# Altium schematic sheet POWER_PCie.SchDoc: DARKYDEN_POWERPCie
size Letter; ApprovedBy: APPROUVÉ PAR; Author: Harold Malbrouck; Organization: Cegep Limoilou; Address1: 1300, 8e Avenue; Address2: Québec, QC; Address3: Canada; Address4: G1J 5L5; Revision: Rev.A; SheetNumber: 6; SheetTotal: 22
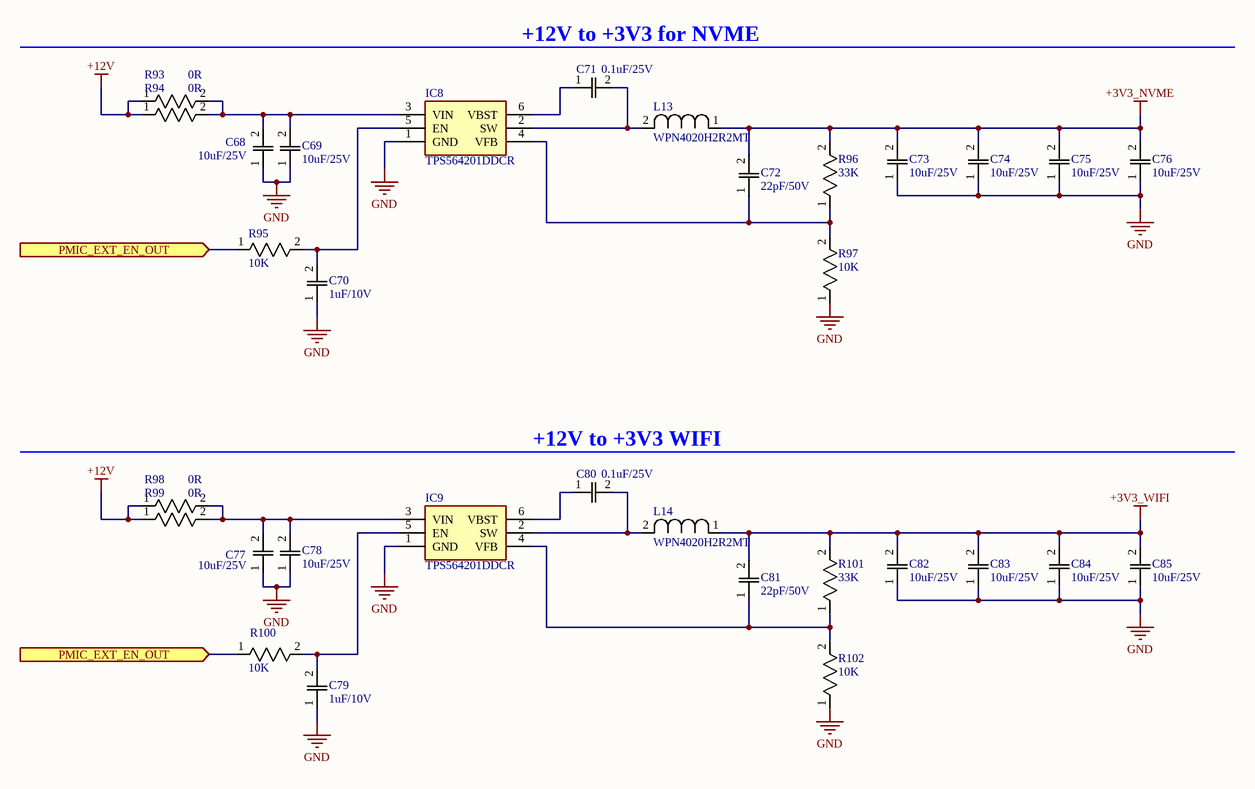
[diagram p0: POWER_PCie.SchDoc]

## Parts
C68  10uF/25V  [CAPC220145_88N_KEM]
C69  10uF/25V  [CAPC220145_88N_KEM]
C70  1uF/10V  [CAPC220145_88N_KEM]
C71  0.1uF/25V  [CAPC220145_88N_KEM]
C72  22pF/50V  [CAPC220145_88N_KEM]
C73  10uF/25V  [CAPC220145_88N_KEM]
C74  10uF/25V  [CAPC220145_88N_KEM]
C75  10uF/25V  [CAPC220145_88N_KEM]
C76  10uF/25V  [CAPC220145_88N_KEM]
C77  10uF/25V  [CAPC220145_88N_KEM]
C78  10uF/25V  [CAPC220145_88N_KEM]
C79  1uF/10V  [CAPC220145_88N_KEM]
C80  0.1uF/25V  [CAPC220145_88N_KEM]
C81  22pF/50V  [CAPC220145_88N_KEM]
C82  10uF/25V  [CAPC220145_88N_KEM]
C83  10uF/25V  [CAPC220145_88N_KEM]
C84  10uF/25V  [CAPC220145_88N_KEM]
C85  10uF/25V  [CAPC220145_88N_KEM]
IC8  TPS564201DDCR  [SOT95P280X110-6N]
IC9  TPS564201DDCR  [SOT95P280X110-6N]
L13  WPN4020H2R2MT  [IND_WPN4020H_SNL]
L14  WPN4020H2R2MT  [IND_WPN4020H_SNL]
R93  0R  [ERJ3EKF1000V]
R94  0R  [ERJ3EKF1000V]
R95  10K  [ERJ3EKF1000V]
R96  33K  [ERJ3EKF1000V]
R97  10K  [ERJ3EKF1000V]
R98  0R  [ERJ3EKF1000V]
R99  0R  [ERJ3EKF1000V]
R100  10K  [ERJ3EKF1000V]
R101  33K  [ERJ3EKF1000V]
R102  10K  [ERJ3EKF1000V]

## Ports
PMIC_EXT_EN_OUT (in, see CONNECTEUR_1[1B], Power[1A], Power[1C], POWER_PCie[1B]), PMIC_EXT_EN_OUT (in, see CONNECTEUR_1[1B], Power[1A], Power[1C], POWER_PCie[1C])

## Nets
+3V3_NVME: C72.2 C73.2 C74.2 C75.2 C76.2 L13.1 R96.2
+3V3_WIFI: C81.2 C82.2 C83.2 C84.2 C85.2 L14.1 R101.2
+12V: R93.1 R94.1 R98.1 R99.1
GND: C68.1 C69.1 C70.1 C73.1 C74.1 C75.1 C76.1 C77.1 C78.1 C79.1 C82.1 C83.1 C84.1 C85.1 IC8.1(GND) IC9.1(GND) R97.1 R102.1
PMIC_EXT_EN_OUT: R95.1 R100.1 ; port PMIC_EXT_EN_OUT
NetC68_2: C68.2 C69.2 IC8.3(VIN) R93.2 R94.2
NetC70_2: C70.2 IC8.5(EN) R95.2
NetC71_1: C71.1 IC8.6(VBST)
NetC71_2: C71.2 IC8.2(SW) L13.2
NetC72_1: C72.1 IC8.4(VFB) R96.1 R97.2
NetC77_2: C77.2 C78.2 IC9.3(VIN) R98.2 R99.2
NetC79_2: C79.2 IC9.5(EN) R100.2
NetC80_1: C80.1 IC9.6(VBST)
NetC80_2: C80.2 IC9.2(SW) L14.2
NetC81_1: C81.1 IC9.4(VFB) R101.1 R102.2

## Notes on the sheet
- (near C71) +12V to +3V3 for NVME
- (near C80) +12V to +3V3 WIFI
- Titre :
- Conception :
- Date :
- Approbation :
- Heure :
- Révision :
- Feuille
- de
- Fichier :

## Library data of the parts
C68 C69 C73-C78 C82-C85 = C0805C106K3PACTU: 10uF / 25 VDC, +85degC, X5R Dielec, +/-10% | KEMET C0805C106K3PACTU 0805; Dielectric Material: Ceramic; Material: 4241ConductorMaterial; Voltage Rating: 25V; Dissipation Factor: 10%; Mfr_Name: Kemet; Supplier: Digikey; Supplier Part Number: 399-11939-1-ND; Manufacturer: KEMET; Manufacturer Part Number: C0805C106K3PACTU; RoHS: Yes; Category: Ceramic Capacitors; Case/Package: 0805; Case Code (Metric): 2012; Case Code (Imperial): 0805; Min Operating Temperature: -55°C; Max Operating Temperature: 85°C; Dielectric: X5R; Packaging: Cut Tape; Voltage: 25V; Termination: Solder; Tolerance: 10%; Value: 10uF; Series: SMD Comm X5R; Voltage Rating (DC): 25V; Length: 2mm; Height: 1.25mm; Depth: 1.25mm; Reach SVHC Compliant: No; RoHS Compliant: Yes; Lead Free: 5697LeadFree; ComponentLink1URL: http://www.farnell.com/datasheets/2741185.pdf?src-supplier=Farnell; ComponentLink1Description: http://www.farnell.com/datasheets/2741185.pdf?src-supplier=Farnell; ComponentLink2URL: http://www.alliedelec.com/m/d/f3c02ddb98afa3dd1adcb801109671e9.pdf?src-supplier=Allied+Electronics; ComponentLink2Description: http://www.alliedelec.com/m/d/f3c02ddb98afa3dd1adcb801109671e9.pdf?src-supplier=Allied+Electronics; ComponentLink3URL: https://api.kemet.com/component-edge/download/datasheet/C0805C106K3PAC7800.pdf?src-supplier=Digikey; ComponentLink3Description: https://api.kemet.com/component-edge/download/datasheet/C0805C106K3PAC7800.pdf?src-supplier=Digikey; ComponentLink4URL: http://www.kemet.com/Lists/ProductCatalog/Attachments/19/KEM_C1006_X5R_SMD.pdf?src-supplier=Avnet; ComponentLink4Description: http://www.kemet.com/Lists/ProductCatalog/Attachments/19/KEM_C1006_X5R_SMD.pdf?src-supplier=Avnet; ComponentLink5URL: http://www.farnell.com/datasheets/2741185.pdf?src-supplier=Element14; ComponentLink5Description: http://www.farnell.com/datasheets/2741185.pdf?src-supplier=Element14; ComponentLink6URL: http://www.farnell.com/datasheets/2741185.pdf?src-supplier=Newark; ComponentLink6Description: http://www.farnell.com/datasheets/2741185.pdf?src-supplier=Newark; ComponentLink7URL: https://datasheet.octopart.com/C0805C106K3PACTU-Kemet-datasheet-46909776.pdf?src-supplier=Element14; ComponentLink7Description: https://datasheet.octopart.com/C0805C106K3PACTU-Kemet-datasheet-46909776.pdf?src-supplier=Element14
C70 C79 = C0805C105K8RACTU: Multilayer Ceramic Capacitors MLCC - SMD/SMT 10V 1uF X7R 0805 10%; Mfr_Name: Kemet; Material: 4241ConductorMaterial; Dissipation Factor: 5%; Supplier: Digikey; Supplier Part Number: 399-C0805C105K8RACTUCT-ND; Manufacturer: KEMET; Manufacturer Part Number: C0805C105K8RACTU; RoHS: Yes; Category: Ceramic Capacitors; Stock: 113387; Pricing: 1=0.2, 10=0.112, 100=0.0701, 1000=0.04837 (USD); Mounting Technology: Surface Mount; Case/Package: 0805; Pins: 2NUMBER; Case Code (Imperial): 0805; Case Code (Metric): 2012; Dielectric Material: Ceramic; Min Operating Temperature: -55°C; Max Operating Temperature: 125°C; Packaging: Tape and Reel; Tolerance: 10%; Value: 1uF; Dielectric: X7R; Package Quantity: 1; Voltage Rating: 10V; Voltage Rating (DC): 10V; Termination: SMD/SMT; Voltage: 10V; Series: C; Construction: Flat; Length: 2mm; Width: 0.049inch; Height: 0.9mm; Depth: 1.25mm; Thickness: 0.039inch; Lead Pitch: 0.75mm; Radiation Hardening: No; Reach SVHC Compliant: No; RoHS Compliant: Yes; Lead Free: 5697LeadFree; ComponentLink1URL: https://datasheet.ciiva.com/6074/kem-c1002-x7r-smd-6074662.pdf?src-supplier=Farnell; ComponentLink1Description: https://datasheet.ciiva.com/6074/kem-c1002-x7r-smd-6074662.pdf?src-supplier=Farnell; ComponentLink2URL: https://datasheet.ciiva.com/22749/1918693-22749723.pdf?src-supplier=Element14; ComponentLink2Description: https://datasheet.ciiva.com/22749/1918693-22749723.pdf?src-supplier=Element14; ComponentLink3URL: https://datasheet.ciiva.com/46385/1851736-46385656.pdf?src-supplier=Element14; ComponentLink3Description: https://datasheet.ciiva.com/46385/1851736-46385656.pdf?src-supplier=Element14; ComponentLink4URL: https://datasheet.ciiva.com/46443/1851736-46443534.pdf?src-supplier=Element14; ComponentLink4Description: https://datasheet.ciiva.com/46443/1851736-46443534.pdf?src-supplier=Element14
C71 C80 = C0805C104K3RACTU: 0.1uF 25V X7R 10% SMD 0805 125C Plastic T/R; Mfr_Name: Kemet; Material: 4241ConductorMaterial; Value: 100nF; Temperature Coefficient: 30ppm/°C; Supplier: Digikey; Supplier Part Number: 399-C0805C104K3RACTUCT-ND; Manufacturer: KEMET; Manufacturer Part Number: C0805C104K3RACTU; RoHS: Yes; Category: Ceramic Capacitors; Mounting Technology: Surface Mount,PCB; Case/Package: 0805; Pins: 2NUMBER; Case Code (Imperial): 0805; Case Code (Metric): 2012; Min Operating Temperature: -55°C; Max Operating Temperature: 125°C; Packaging: Tape and Reel; Tolerance: 10%; Dielectric: X7R; Termination: SMD/SMT; Package Quantity: 4000; Voltage Rating: 25V; Series: SMD Comm X7R; Voltage Rating (DC): 25V; Construction: Flat; Length: 2mm; Width: 1.2mm; Height: 0.9mm; Depth: 1.25mm; Lead Pitch: 0.75mm; Thickness: 889um; Radiation Hardening: No; RoHS Compliant: Yes; Lead Free: 5697LeadFree; Reach SVHC Compliant: 4186SVHC; ComponentLink1URL: https://datasheet.ciiva.com/7842/kem-c1002-x7r-smd-7842536.pdf?src-supplier=Element14; ComponentLink1Description: https://datasheet.ciiva.com/7842/kem-c1002-x7r-smd-7842536.pdf?src-supplier=Element14; ComponentLink2URL: https://datasheet.ciiva.com/7842/kem-c1002-x7r-smd-7842538.pdf?src-supplier=Element14; ComponentLink2Description: https://datasheet.ciiva.com/7842/kem-c1002-x7r-smd-7842538.pdf?src-supplier=Element14
C72 C81 = C0805C220J5RACTU: Cap Ceramic 22pF 50V X7R 5% Pad SMD 0805 125°C T/R; Mfr_Name: Kemet; Temperature Coefficient: 30ppm/°C; Supplier: Digikey; Supplier Part Number: 399-17625-1-ND; Manufacturer: KEMET; Manufacturer Part Number: C0805C220J5RACTU; RoHS: Yes; Category: Ceramic Capacitors; Stock: 8069; Pricing: 1=0.13, 10=0.072, 100=0.0434, 1000=0.02906 (USD); Case/Package: 0805; Material: Ceramic; Dielectric Material: Ceramic; Min Operating Temperature: -55°C; Max Operating Temperature: 125°C; Value: 22pF; Dielectric: X7R; Voltage Rating: 50V; Voltage Rating (DC): 50V; Height: 880um; RoHS Compliant: Yes; ComponentLink1URL: https://datasheet.octopart.com/C0805C220J5RACTU-KEMET-datasheet-130256537.pdf?src-supplier=Farnell; ComponentLink1Description: https://datasheet.octopart.com/C0805C220J5RACTU-KEMET-datasheet-130256537.pdf?src-supplier=Farnell; ComponentLink2URL: https://datasheet.octopart.com/C0805C220J5RACTU-KEMET-datasheet-170333836.pdf?src-supplier=Newark; ComponentLink2Description: https://datasheet.octopart.com/C0805C220J5RACTU-KEMET-datasheet-170333836.pdf?src-supplier=Newark
IC8 IC9 = TPS564201DDCR: IC REG BUCK ADJ 4A SOT23 "Buck Switching Regulator IC Positive Adjustable 0.76V 1 Output 4A SOT-23-6 Thin, TSOT-23-6"; Manufacturer_Name: Texas Instruments; Number of Outputs: 1; Min Input Voltage: 4.5V; Max Supply Voltage: 17V; Min Output Voltage: 760mV; Max Output Voltage: 7V; Switching Frequency: 560kHz; Synchronous Rectifier: Yes; Quiescent Current: 400uA; Datasheet Link: http://www.ti.com/lit/gpn/tps564201; Height: 1.1mm; Manufacturer_Part_Number: TPS564201DDCR; Mouser Part Number: 595-TPS564201DDCR; Mouser Price/Stock: https://www.mouser.co.uk/ProductDetail/Texas-Instruments/TPS564201DDCR?qs=zEmsApcVOkUKQpyzRnH%2FcQ%3D%3D; Arrow Part Number: TPS564201DDCR; Arrow Price/Stock: https://www.arrow.com/en/products/tps564201ddcr/texas-instruments?region=nac; Supplier: Digikey; Supplier Part Number: 296-47373-1-ND; Manufacturer: Texas Instruments; Manufacturer Part Number: TPS564201DDCR; RoHS: Yes; Category: Voltage Regulators - Switching; Mounting Technology: Surface Mount; Case/Package: SOT-23-6; Pins: 6; Min Operating Temperature: -40°C; Max Operating Temperature: 125°C; Packaging: Cut Tape; Output Current: 4A; Output Type: Adjustable; Output Configuration: Positive; Series: D-CAP2™; Number of Channels: 1; Length: 2.9mm; Width: 1.6mm; Thickness: 870um; Lead Free: Lead Free; RoHS Compliant: Yes; ComponentLink1URL: http://www.ti.com/lit/ds/symlink/tps564201.pdf?src-supplier=Digikey; ComponentLink1Description: http://www.ti.com/lit/ds/symlink/tps564201.pdf?src-supplier=Digikey; ComponentLink2URL: http://www.ti.com/general/docs/suppproductinfo.tsp?distId=10&amp;gotoUrl=http%3A%2F%2Fwww.ti.com%2Flit%2Fgpn%2Ftps564201&src-supplier=Digikey; ComponentLink2Description: http://www.ti.com/general/docs/suppproductinfo.tsp?distId=10&amp;gotoUrl=http%3A%2F%2Fwww.ti.com%2Flit%2Fgpn%2Ftps564201&src-supplier=Digikey
L13 L14 = WPN4020H2R2MT: 2.2 µH Shielded Drum Core, Wirewound Inductor 4.3 A 48mOhm Max Nonstandard; Mfr_Name: Sunlord; Type: Fixed Inductors; Supplier: Digikey; Supplier Part Number: 3442-WPN4020H2R2MTCT-ND; Manufacturer: Sunlord; Manufacturer Part Number: WPN4020H2R2MT; RoHS: No; Category: Fixed Inductors
R93 R94 R98 R99 = ERJ-3GEY0R00V: Zero Ohm Resistor, Jumper, 0603 [1608 Metric], Thick Film, 100 mW, 1 A, Surface Mount; Manufacturer_Name: Panasonic; Power Rating: 100mW; Voltage Rating: 75V; Tolerance: 0%; Temperature Coefficient: 200ppm/°C; Datasheet Link: http://docs-europe.electrocomponents.com/webdocs/13ba/0900766b813ba21b.pdf; Height: 0.55mm; Manufacturer_Part_Number: ERJ-3GEY0R00V; Mouser Part Number: 667-ERJ-3GEY0R00V; Mouser Price/Stock: https://www.mouser.co.uk/ProductDetail/Panasonic/ERJ-3GEY0R00V?qs=66DK8nO8gJALIOqOWgiVwg%3D%3D; Arrow Part Number: ERJ-3GEY0R00V; Arrow Price/Stock: https://www.arrow.com/en/products/erj3gey0r00v/panasonic?region=europe; Supplier: Digikey; Supplier Part Number: P0.0GCT-ND; Manufacturer: Panasonic; Manufacturer Part Number: ERJ-3GEY0R00V; RoHS: Yes; Category: Chip SMD Resistors; Stock: 766631; Pricing: 1=0.1, 10=0.02, 25=0.0164, 50=0.0144, 100=0.0126, 250=0.0106, 500=0.00936, 1000=0.0083 (USD); Mounting Technology: Surface Mount; Case/Package: 0603; Case Code (Metric): 1608; Case Code (Imperial): 0603; Contact Plating: Tin; Min Operating Temperature: -55°C; Max Operating Temperature: 155°C; Packaging: Tape and Reel; Package Quantity: 5000; Value: 0R; Resistor Type: Thick Film; Number of Terminations: 2; Termination: SMD/SMT; Max Power Dissipation: 100mW; Features: Automotive AEC-Q200; Series: ERJ; Construction: Rectangular; Technology: THICK FILM; Length: 1.6mm; Width: 0.8mm; Depth: 0.8mm; Ratings: AEC-Q200; Radiation Hardening: No; Reach SVHC Compliant: No; Military Standard: Not; RoHS Compliant: Yes; Lead Free: 5697LeadFree; ComponentLink1URL: https://datasheet.ciiva.com/11808/0900766b80f806dd-11808207.pdf?src-supplier=Rs; ComponentLink1Description: https://datasheet.ciiva.com/11808/0900766b80f806dd-11808207.pdf?src-supplier=Rs; ComponentLink2URL: https://datasheet.ciiva.com/27055/1935748-27055113.pdf?src-supplier=Jameco; ComponentLink2Description: https://datasheet.ciiva.com/27055/1935748-27055113.pdf?src-supplier=Jameco; ComponentLink3URL: https://datasheet.ciiva.com/5959/1678796-5959707.pdf?src-supplier=Farnell; ComponentLink3Description: https://datasheet.ciiva.com/5959/1678796-5959707.pdf?src-supplier=Farnell; ComponentLink4URL: https://datasheet.ciiva.com/43460/1678796-43460647.pdf?src-supplier=Farnell; ComponentLink4Description: https://datasheet.ciiva.com/43460/1678796-43460647.pdf?src-supplier=Farnell; ComponentLink5URL: https://datasheet.ciiva.com/48532/aoa0000ce1-48532165.pdf?src-supplier=Avnet; ComponentLink5Description: https://datasheet.ciiva.com/48532/aoa0000ce1-48532165.pdf?src-supplier=Avnet; ComponentLink6URL: https://datasheet.ciiva.com/28695/1678796-28695833.pdf?src-supplier=Element14; ComponentLink6Description: https://datasheet.ciiva.com/28695/1678796-28695833.pdf?src-supplier=Element14; ComponentLink7URL: https://datasheet.ciiva.com/16834/aoa0000ce1-16834828.pdf?src-supplier=Future+Electronics; ComponentLink7Description: https://datasheet.ciiva.com/16834/aoa0000ce1-16834828.pdf?src-supplier=Future+Electronics; ComponentLink8URL: https://datasheet.ciiva.com/16758/70255313-16758527.pdf?src-supplier=Allied+Electronics; ComponentLink8Description: https://datasheet.ciiva.com/16758/70255313-16758527.pdf?src-supplier=Allied+Electronics; ComponentLink9URL: https://datasheet.ciiva.com/30199/4aoa0000ce1-30199822.pdf?src-supplier=Onlinecomponents.com; ComponentLink9Description: https://datasheet.ciiva.com/30199/4aoa0000ce1-30199822.pdf?src-supplier=Onlinecomponents.com; ComponentLink10URL: https://datasheet.ciiva.com/46377/1678796-46377868.pdf?src-supplier=Element14; ComponentLink10Description: https://datasheet.ciiva.com/46377/1678796-46377868.pdf?src-supplier=Element14; ComponentLink11URL: https://datasheet.ciiva.com/9198/aoa0000ce1-9198975.pdf?src-supplier=Avnet; ComponentLink11Description: https://datasheet.ciiva.com/9198/aoa0000ce1-9198975.pdf?src-supplier=Avnet
R95 R97 R100 R102 = ERJ-3GEYJ103V: 10K Ohm 5% Res Thick Film 0603  0.1W(1/10W) ±200ppm/C Pad SMD Automotive T/R; Manufacturer_Name: Panasonic; Value: 10kR; Temperature Coefficient: 200ppm/°C; Power Rating: 100mW; Voltage Rating: 75V; Datasheet Link: http://docs-europe.electrocomponents.com/webdocs/13ba/0900766b813ba21b.pdf; Height: 0.55mm; Manufacturer_Part_Number: ERJ-3GEYJ103V; Mouser Part Number: 667-ERJ-3GEYJ103V; Mouser Price/Stock: https://www.mouser.co.uk/ProductDetail/Panasonic/ERJ-3GEYJ103V?qs=66DK8nO8gJBWgc%252B0VNNxzg%3D%3D; Arrow Part Number: ERJ-3GEYJ103V; Arrow Price/Stock: https://www.arrow.com/en/products/erj-3geyj103v/panasonic?region=europe; Supplier: Digikey; Supplier Part Number: P10KGCT-ND; Manufacturer: Panasonic; Manufacturer Part Number: ERJ-3GEYJ103V; RoHS: Yes; Category: Chip SMD Resistors; Stock: 2191587; Pricing: 1=0.1, 10=0.033, 50=0.02, 100=0.0165, 500=0.01096, 1000=0.00939 (USD); Mounting Technology: Surface Mount; Case/Package: 0603; Case Code (Imperial): 0603; Case Code (Metric): 1608; Weight: 7.1E-05oz; Contact Plating: Tin; Min Operating Temperature: -55°C; Max Operating Temperature: 155°C; Tolerance: 5%; Packaging: Tape and Reel; Technology: THICK FILM; Package Quantity: 1; Resistor Type: Thick Film; Termination: SMD/SMT; Number of Terminations: 2; Max Power Dissipation: 100mW; Working Voltage: 75V; Features: Automotive AEC-Q200; Series: ERJ; Construction: Rectangular; Resistance Tolerance: 5%; Length: 1.6mm; Width: 0.8mm; Depth: 0.8mm; Reach SVHC Compliant: No; Military Standard: Not; Lead Free: Lead Free; RoHS Compliant: Yes; ComponentLink1URL: https://datasheet.ciiva.com/11809/0900766b80f806dd-11809566.pdf?src-supplier=Rs; ComponentLink1Description: https://datasheet.ciiva.com/11809/0900766b80f806dd-11809566.pdf?src-supplier=Rs; ComponentLink2URL: https://datasheet.ciiva.com/34303/2007265-34303757.pdf?src-supplier=Jameco; ComponentLink2Description: https://datasheet.ciiva.com/34303/2007265-34303757.pdf?src-supplier=Jameco; ComponentLink3URL: https://datasheet.ciiva.com/48531/aoa0000ce1-48531887.pdf?src-supplier=Avnet; ComponentLink3Description: https://datasheet.ciiva.com/48531/aoa0000ce1-48531887.pdf?src-supplier=Avnet; ComponentLink4URL: https://datasheet.ciiva.com/9117/aoa0000ce1-9117038.pdf?src-supplier=Avnet; ComponentLink4Description: https://datasheet.ciiva.com/9117/aoa0000ce1-9117038.pdf?src-supplier=Avnet; ComponentLink5URL: https://datasheet.ciiva.com/28514/1678796-28514213.pdf?src-supplier=Element14; ComponentLink5Description: https://datasheet.ciiva.com/28514/1678796-28514213.pdf?src-supplier=Element14; ComponentLink6URL: https://datasheet.ciiva.com/46371/1678796-46371909.pdf?src-supplier=Element14; ComponentLink6Description: https://datasheet.ciiva.com/46371/1678796-46371909.pdf?src-supplier=Element14; ComponentLink7URL: https://datasheet.ciiva.com/46385/1678796-46385240.pdf?src-supplier=Element14; ComponentLink7Description: https://datasheet.ciiva.com/46385/1678796-46385240.pdf?src-supplier=Element14; ComponentLink8URL: https://datasheet.ciiva.com/24133/aoa0000ce1-37422-24133064.pdf?src-supplier=Mouser; ComponentLink8Description: https://datasheet.ciiva.com/24133/aoa0000ce1-37422-24133064.pdf?src-supplier=Mouser; ComponentLink9URL: https://datasheet.ciiva.com/16740/aoa0000ce1-16740655.pdf?src-supplier=Future+Electronics; ComponentLink9Description: https://datasheet.ciiva.com/16740/aoa0000ce1-16740655.pdf?src-supplier=Future+Electronics; ComponentLink10URL: https://datasheet.ciiva.com/30147/4aoa0000ce1-30147029.pdf?src-supplier=Onlinecomponents.com; ComponentLink10Description: https://datasheet.ciiva.com/30147/4aoa0000ce1-30147029.pdf?src-supplier=Onlinecomponents.com
R96 R101 = ERJ-3GEYJ333V: 33K Ohm 0603  5% 0.1W(1/10W) +/-200ppm/ßC SMD Automotive T/R; Manufacturer_Name: Panasonic; Value: 33kR; Power Rating: 100mW; Voltage Rating: 75V; Temperature Coefficient: 200ppm/°C; Datasheet Link: http://docs-europe.electrocomponents.com/webdocs/13ba/0900766b813ba21b.pdf; Height: 0.55mm; Manufacturer_Part_Number: ERJ-3GEYJ333V; Mouser Part Number: 667-ERJ-3GEYJ333V; Mouser Price/Stock: https://www.mouser.co.uk/ProductDetail/Panasonic/ERJ-3GEYJ333V?qs=JjxTDIFmKPQB8Hd2hIsG7w%3D%3D; Supplier: Avnet; Supplier Part Number: 65T8631; Manufacturer: Panasonic; Manufacturer Part Number: ERJ-3GEYJ333V; RoHS: Yes; Category: Chip SMD Resistors; Mounting Technology: Surface Mount; Case/Package: 0603; Case Code (Metric): 1608; Case Code (Imperial): 0603; Contact Plating: Tin; Min Operating Temperature: -55°C; Max Operating Temperature: 155°C; Tolerance: 5%; Packaging: Tape and Reel; Package Quantity: 1; Resistor Type: Thick Film; Number of Terminations: 2; Termination: SMD/SMT; Max Power Dissipation: 100mW; Features: Automotive AEC-Q200; Series: ERJ; Construction: Rectangular; Technology: THICK FILM; Resistance Tolerance: 5%; Length: 1.6mm; Width: 0.8mm; Depth: 0.8mm; Radiation Hardening: No; Reach SVHC Compliant: No; Military Standard: Not; Lead Free: Lead Free; RoHS Compliant: Yes; ComponentLink1URL: https://datasheet.ciiva.com/11821/0900766b80f806dd-11821443.pdf?src-supplier=Rs; ComponentLink1Description: https://datasheet.ciiva.com/11821/0900766b80f806dd-11821443.pdf?src-supplier=Rs; ComponentLink2URL: https://datasheet.ciiva.com/6082/1500035-6082201.pdf?src-supplier=Farnell; ComponentLink2Description: https://datasheet.ciiva.com/6082/1500035-6082201.pdf?src-supplier=Farnell; ComponentLink3URL: https://datasheet.ciiva.com/43460/1500035-43460750.pdf?src-supplier=Farnell; ComponentLink3Description: https://datasheet.ciiva.com/43460/1500035-43460750.pdf?src-supplier=Farnell; ComponentLink4URL: https://datasheet.ciiva.com/9117/aoa0000ce1-9117178.pdf?src-supplier=Avnet; ComponentLink4Description: https://datasheet.ciiva.com/9117/aoa0000ce1-9117178.pdf?src-supplier=Avnet; ComponentLink5URL: https://datasheet.ciiva.com/16788/70255313-16788733.pdf?src-supplier=Allied+Electronics; ComponentLink5Description: https://datasheet.ciiva.com/16788/70255313-16788733.pdf?src-supplier=Allied+Electronics; ComponentLink6URL: https://datasheet.ciiva.com/30068/4aoa0000ce1-30068957.pdf?src-supplier=Onlinecomponents.com; ComponentLink6Description: https://datasheet.ciiva.com/30068/4aoa0000ce1-30068957.pdf?src-supplier=Onlinecomponents.com; ComponentLink7URL: https://datasheet.ciiva.com/16765/70255313-16765226.pdf?src-supplier=Allied+Electronics; ComponentLink7Description: https://datasheet.ciiva.com/16765/70255313-16765226.pdf?src-supplier=Allied+Electronics; ComponentLink8URL: https://datasheet.ciiva.com/28682/1678796-28682159.pdf?src-supplier=Element14; ComponentLink8Description: https://datasheet.ciiva.com/28682/1678796-28682159.pdf?src-supplier=Element14; ComponentLink9URL: https://datasheet.ciiva.com/46377/1500035-46377061.pdf?src-supplier=Element14; ComponentLink9Description: https://datasheet.ciiva.com/46377/1500035-46377061.pdf?src-supplier=Element14; ComponentLink10URL: https://datasheet.ciiva.com/46388/1500035-46388634.pdf?src-supplier=Element14; ComponentLink10Description: https://datasheet.ciiva.com/46388/1500035-46388634.pdf?src-supplier=Element14